# Altium schematic sheet SPE_router_spe.SchDoc: SPE Router
size 420 x 297 mm; Author: P. Daniel; CompanyName: WUT ISE; DrawnBy: P. Daniel; Organization: WUT ISE; Address1: WUT ISE; Address2: Nowowiejska 15/19 00-665 Warsaw; Address3: piotrmaciejdaniel@gmail.com; Revision: 1; SheetNumber: 4; SheetTotal: 4; ModifiedBy: -; CreateDate: 02-03.2023; CheckedDate: -; Title2: SPE PHY; DivGrp: WUT ISE; Designer: Piotr Daniel
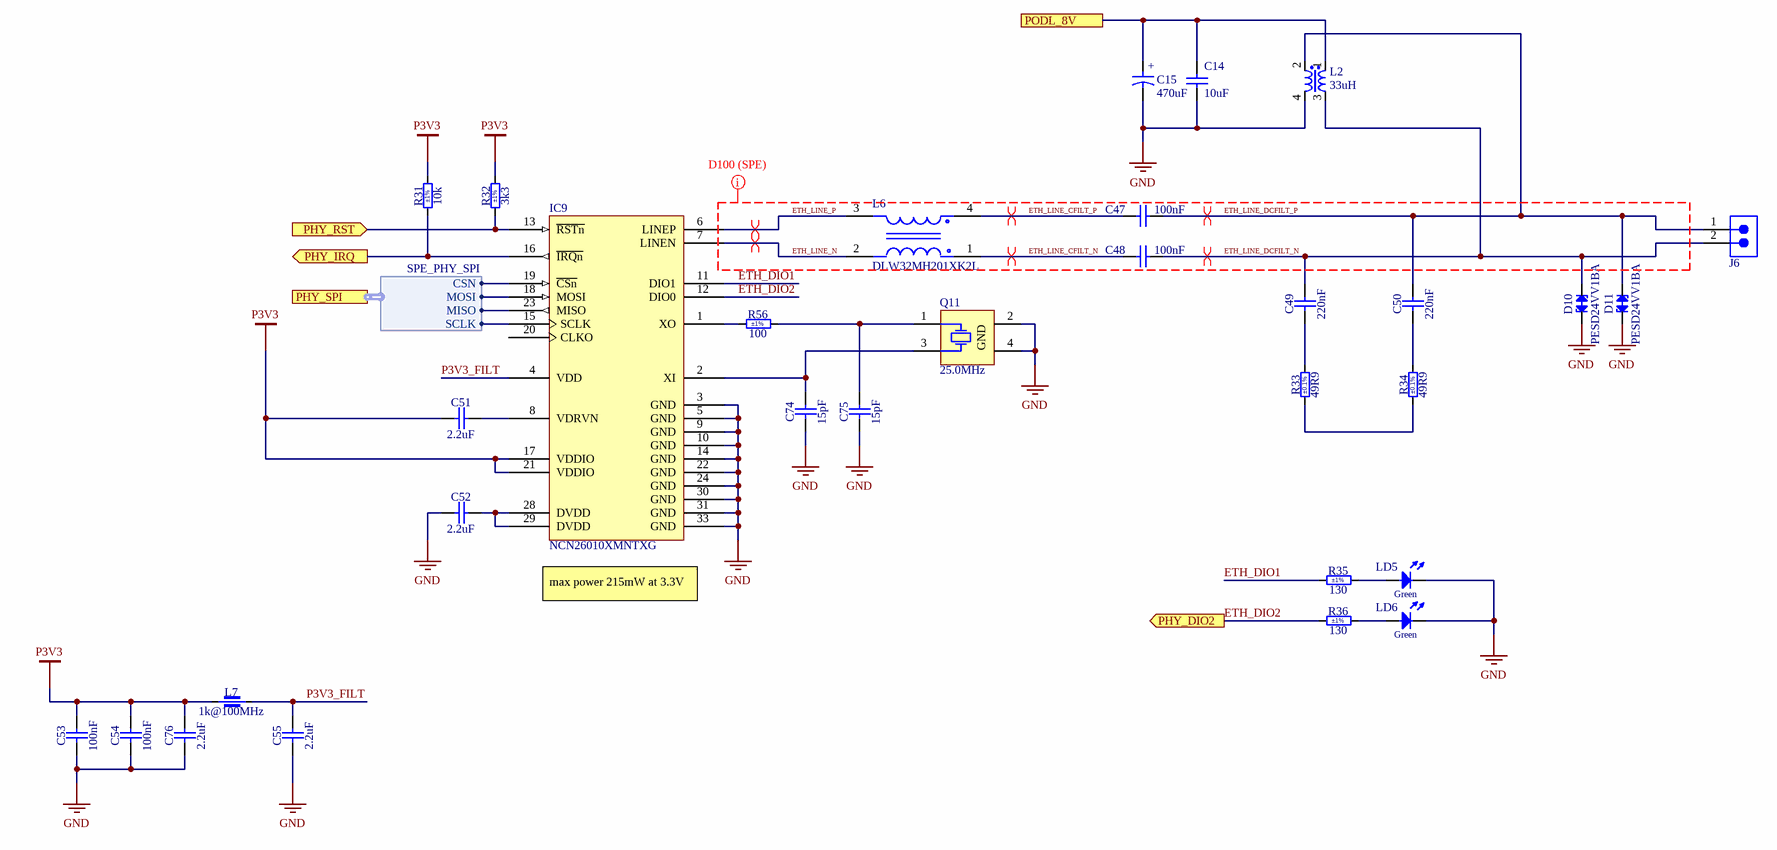
[diagram p0: SPE_router_spe.SchDoc]

## Parts
C14  10uF  [CAPC3216X180N]
C15  470uF  [CAPAE830X1020N]
C47  100nF  [CAPC1005X55N]
C48  100nF  [CAPC1005X55N]
C49  220nF  [CAPC2012X135N]
C50  220nF  [CAPC2012X135N]
C51  2.2uF  [CAPC1005X55N]
C52  2.2uF  [CAPC1005X55N]
C53  100nF  [CAPC1005X55N]
C54  100nF  [CAPC1005X55N]
C55  2.2uF  [CAPC1005X55N]
C74  15pF  [CAPC1005X55N]
C75  15pF  [CAPC1005X55N]
C76  2.2uF  [CAPC1005X55N]
D10  PESD24VV1BA  [SOD2512X110N]
D11  PESD24VV1BA  [SOD2512X110N]
IC9  NCN26010XMNTXG  [QFN40P400X400X100_HS-33N]
J6  691382040002  [691382040002]  (value not drawn)
L2  33uH  [MSD1278H-333MED]
L6  DLW32MH201XK2L  [FP-DLW32MH201XK2L-MFG]
L7  1k@100MHz  [INDC1608X100N]
LD5  Green  [LED_AVAGO_HSME-C110]
LD6  Green  [LED_AVAGO_HSME-C110]
Q11  25.0MHz  [XTAL_KYOCERA_CX3225SB]
R31  10k  Tolerance: ±1%  [RESC1005X40N]
R32  3k3  Tolerance: ±1%  [RESC1005X40N]
R33  49R9  Tolerance: ±0.1%  [RESC1608X55N]
R34  49R9  Tolerance: ±0.1%  [RESC1608X55N]
R35  130  Tolerance: ±1%  [RESC1005X40N]
R36  130  Tolerance: ±1%  [RESC1005X40N]
R56  100  Tolerance: ±1%  [RESC1005X40N]

## Ports
PHY_DIO2 (out), PHY_IRQ (out), PHY_RST (in), PHY_SPI (harness SPE_PHY_SPI), PODL_8V

## Harnesses
SPE_PHY_SPI: CSN, SCLK, MOSI, MISO

## Nets
GND: C14.1 C15.2 C52.1 C53.1 C54.1 C55.1 C74.1 C75.1 C76.1 D10.1(C) D11.1(C) IC9.3(GND) IC9.5(GND) IC9.9(GND) IC9.10(GND) IC9.14(GND) IC9.22(GND) IC9.24(GND) IC9.30(GND) IC9.31(GND) IC9.33(GND) L2.4 LD5.1(C) LD6.1(C) Q11.2(GND) Q11.4(GND)
P3V3: C51.1 C53.2 C54.2 C76.2 IC9.17(VDDIO) IC9.21(VDDIO) L7.1 R31.2 R32.2
ETH_DIO1: IC9.11(DIO1) R35.1
ETH_DIO2: IC9.12(DIO0) R36.1 ; port PHY_DIO2
ETH_LINE_CFILT_N: C48.1 L6.1
ETH_LINE_CFILT_P: C47.1 L6.4
ETH_LINE_DCFILT_N: C48.2 C49.2 D10.2(C) J6.2 L2.3
ETH_LINE_DCFILT_P: C47.2 C50.2 D11.2(C) J6.1 L2.2
ETH_LINE_N: IC9.7(LINEN) L6.2
ETH_LINE_P: IC9.6(LINEP) L6.3
P3V3_FILT: C55.2 IC9.4(VDD) L7.2
PHY_IRQ: IC9.16(~{IRQn}) R31.1 ; port PHY_IRQ
PHY_RST: IC9.13(~{RSTn}) R32.1 ; port PHY_RST
PODL_8V: C14.2 C15.1 L2.1 ; port PODL_8V
NetC49_1: C49.1 R33.2
NetC50_1: C50.1 R34.2
NetC51_2: C51.2 IC9.8(VDRVN)
NetC52_2: C52.2 IC9.28(DVDD) IC9.29(DVDD)
NetC74_2: C74.2 IC9.2(XI) Q11.3(X)
NetC75_2: C75.2 Q11.1(X) R56.2
NetIC9_1: IC9.1(XO) R56.1
NetIC9_15: IC9.15(SCLK) ; port PHY_SPI.SCLK
NetIC9_18: IC9.18(MOSI) ; port PHY_SPI.MOSI
NetIC9_19: IC9.19(~{CSn}) ; port PHY_SPI.CSN
NetIC9_23: IC9.23(MISO) ; port PHY_SPI.MISO
NetLD5_2: LD5.2(A) R35.2
NetLD6_2: LD6.2(A) R36.2
NetR33_1: R33.1 R34.1

Not connected (* = marked no-connect by the designer): IC9 20(CLKO)

## Layout directives
differential pair: ETH_LINE_CFILT_N, ETH_LINE_CFILT_P, ETH_LINE_DCFILT_N, ETH_LINE_DCFILT_P, ETH_LINE_N, ETH_LINE_P
rule Differential Pairs Routing [Pref Gap = 5mil    Min Gap  = 5mil    Max Gap  = 5milPref Width = 9.076mil    Min Width  = 3.515mil    Max Width  = 9.076mil]: ETH_LINE_CFILT_N, ETH_LINE_CFILT_P, ETH_LINE_DCFILT_N, ETH_LINE_DCFILT_P, ETH_LINE_N, ETH_LINE_P

## Notes on the sheet
- (near IC9) max power 215mW at 3.3V
- Project/Equipment
- Document
- Designer
- Drawn by
- Check.by
- Copyright WUT ISE 2021.
  This documentation describes Open Hardware and is licensed under the CERN OHL v.1.1. You may redistribute and modify this documentation under the terms of the CERN OHL v.1.1. (http://ohwr.org/CERNOHL). This documentation is distributed WITHOUT ANY EXPRESS OR IMPLIED WARRANTY, INCLUDING OF MERCHANTABILITY, SATISFACTORY QUALITY AND FITNESS FOR A PARTICULAR PURPOSE. Please see the CERN OHL v.1.1 for applicable conditions.
- Contact
- File
- Last Mod.
- Print Date
- Sheet
- Size
- A3
- of
- Rev
- (in symbol CAE830-1020_470UF_16V_20%) +

## Library data of the parts
C14 = CC1206_10UF_25V_10%_X7R: Non-polarised capacitor; Part Description: SMD Multilayer Chip Ceramic Capacitor; Manufacturer: GENERIC; Manufacturer1 Part Number: C1206C106K4RACTU; Voltage: 25V; TC: X7R; Tolerance: ±10%; Part Number: CC1206_10UF_25V_10%_X7R; Component Kind: Standard; Component Type: Standard; Pin Count: 2; Value: 10uF; Status: Preferred; Manufacturer Part Number: CC1206_10UF_25V_10%_X7R; Case: 1206; Mounted: Yes; Socket: No; SMD: Yes; Sense: No; Manufacturer1 Example: KEMET; Manufacturer1 ComponentHeight: 1.8mm; HelpURL: \\cern.ch\dfs\Applications\Altium\Datasheets\CC1206_X7R_KEMET.pdf; Author: CERN DEM JLC; CreateDate: 12.09.2012; LatestRevisionDate: 12.09.2012
C15 = CAE830-1020_470UF_16V_20%: Polarised capacitor; Part Description: Aluminum Electrolytic SMT Capacitor; Manufacturer: PANASONIC; Manufacturer Part Number: EEEFK1C471AP; Voltage: 16V; Tolerance: ±20%; Part Number: CAE830-1020_470UF_16V_20%; Component Kind: Standard; Component Type: Standard; Pin Count: 2; Value: 470uF; Status: Not Recommended; Case: F; Mounted: Yes; Socket: No; SMD: Yes; Sense: No; ComponentHeight: 10.2mm; HelpURL: \\cern.ch\dfs\Applications\Altium\Datasheets\CAE_PANASONIC_FK-V.pdf; Author: CERN DEM JLC; CreateDate: 03.12.2007; LatestRevisionDate: 05.11.2014
C47 C48 = CC0402_100NF_50V_10%_X7R: Non-polarised capacitor; Part Number: CC0402_100NF_50V_10%_X7R; Value: 100nF
C49 C50 = CC0805_220NF_100V_10%_X7R: Non-polarised capacitor; Part Description: SMD Multilayer Chip Ceramic Capacitor; Manufacturer: GENERIC; Manufacturer1 Part Number: GRM21AR72A224KAC5L; Voltage: 100V; TC: X7R; Tolerance: ±10%; Part Number: CC0805_220NF_100V_10%_X7R; Component Kind: Standard; Component Type: Standard; Pin Count: 2; Value: 220nF; Status: Preferred; Manufacturer Part Number: CC0805_220NF_100V_10%_X7R; Case: 0805; Mounted: Yes; Socket: No; SMD: Yes; Sense: No; Manufacturer1 Example: MURATA; Manufacturer1 ComponentHeight: 1mm; HelpURL: \\cern.ch\dfs\Applications\Altium\Datasheets\CC0805_MURATA_GRM21AR72A224KAC5L.pdf; Author: CERN DEM JLC; CreateDate: 08.06.2017; LatestRevisionDate: 08.06.2017
C51 C52 C55 C76 = CC0402_2.2UF_6.3V_10%_X5R: Non-polarised capacitor; Part Number: CC0402_2.2UF_6.3V_10%_X5R; Value: 2.2uF
C53 C54 = CC0402_100NF_16V_10%_X7R: Non-polarised capacitor; Part Description: SMD Multilayer Chip Ceramic Capacitor; Manufacturer: GENERIC; Manufacturer1 Part Number: GRM155R71C104KA88D; Voltage: 16V; TC: X7R; Tolerance: ±10%; Part Number: CC0402_100NF_16V_10%_X7R; Component Kind: Standard; Component Type: Standard; Pin Count: 2; Value: 100nF; Status: Not Recommended; Manufacturer Part Number: CC0402_100NF_16V_10%_X7R; Case: 0402; Mounted: Yes; Socket: No; SMD: Yes; Sense: No; Manufacturer1 Example: MURATA; Manufacturer1 ComponentHeight: 0.55mm; HelpURL: \\cern.ch\dfs\Applications\Altium\Datasheets\CC0402_X7R_MURATA_GRM.pdf; Author: CERN DEM JLC; CreateDate: 05.12.2013; LatestRevisionDate: 03.12.2007
C74 C75 = CC0402_15PF_50V_5%_C0G: Non-polarised capacitor; Part Description: SMD Multilayer Chip Ceramic Capacitor; Manufacturer: GENERIC; Manufacturer1 Part Number: C0402C150J5GACTU; Voltage: 50V; TC: C0G/NP0; Tolerance: ±5%; Part Number: CC0402_15PF_50V_5%_C0G; Component Kind: Standard; Component Type: Standard; Pin Count: 2; Value: 15pF; Status: Preferred; Manufacturer Part Number: CC0402_15PF_50V_5%_C0G; Case: 0402; Mounted: Yes; Socket: No; SMD: Yes; Sense: No; Manufacturer1 Example: KEMET; Manufacturer1 ComponentHeight: 0.55mm; HelpURL: \\cern.ch\dfs\Applications\Altium\Datasheets\CC0402_C0G_KEMET_(Commercial Grade).pdf; Author: CERN DEM JLC; CreateDate: 03.12.2007; LatestRevisionDate: 22.04.2015
D10 D11 = PESD24VL1BA: Bi-Directional ESD Protection Diode; Part Description: Low Capacitance 23kV Bidirectional ESD Protection Diode; Manufacturer: NXP SEMICONDUCTORS; Voltage: 24V; Power: 200W; PressFit: No; Bonding: No; Part Number: PESD24VV1BA; Component Kind: Standard; Component Type: Standard; Device: PESD24VV1BA; PackageDescription: Small Outline Diode (SOD-323), 1.70mm W X 1.25mm L X 1.10mm H body,  IPC Medium Density; Manufacturer Part Number: PESD24VV1BA; Pin Count: 2; Case: SOD323; Mounted: Yes; Socket: No; SMD: Yes; Sense: No; ComponentHeight: 1.1mm; HelpURL: \\cern.ch\dfs\Applications\Altium\Datasheets\PESD24VL1BA.pdf; Author: CERN DEM JLC; CreateDate: 26.02.2013; LatestRevisionDate: 26.02.2013
IC9 = NCN26010XMNTXG: Ethernet Controller, 10 Mb/s, Single-Pair, MAC + PHY, 802.3cg, 10BASE−T1S Compliant; Manufacturer: ON Semiconductor; Supplier 1: Arrow Electronics; Manufacturer Part Number: NCN26010XMNTXG; RoHS: No; Stock 1: 369; Pricing 1: 1=7,29220, 10=6,57460, 25=6,24800, 100=5,59360, 250=5,34180 (USD); Supplier Part Number 1: NCN26010XMNTXG
J6 = 691382040002: WR-TBL Series 382 Horizontal PCB Header with Flanges, THT, pitch 2.5mm, 2p; Manufacturer: Wurth Elektronik; Modularity: No; Rated Current: 12A; Working Voltage: 300V; ComponentLink1Description: Website Link; ComponentLink1URL: https://www.we-online.com/redexpert/article/691382040002?ad; ComponentLink2Description: Datasheet Link; ComponentLink2URL: https://www.we-online.com/redexpert/spec/691382040002?ad; Manufacturer Part Number: 691382040002; Category: Terminal Blocks; Match Code: WR-TBL; Mount: Through Hole; Operating Temperature Max: 105°C; Operating Temperature Min: -40°C; Packaging: Box; Application: Pluggable; Number of Pins: 2; Number of Rows: 1; Orientation: Horizontal; Pitch: 2.5mm
L2 = MSD1278H-333MED: coupled inductor, ferrite core, SMT, RoHS; Manufacturer: Coilcraft; Manufacturer Part Number: MSD1278H-333MED; RoHS: Yes; Category: Inductors; Stock 1: 123; RoHS Compliant: No
L6 = CMP-06045-000003-1: 200UH-20%/+50% (AT 0.1MHZ)70MA R; Manufacturer: Murata; Inductance: 200uH; Automotive Grade: Grade 1; Tolerance: -20/+50%; Value: 200uH; Series Resistance: 4.8Ω; Automotive: Yes; Manufacturer Part Number: DLW32MH201XK2L; Temperature Range Low: -40°C; ComponentLink2URL: https://www.murata.com/products/productdata/8801029685278/QFLC9124.pdf?1544104811000; Lead Free: Yes; Device Class L3: Common Mode Chokes; Device Class L2: EMI / RFI Components; Rms Current: 70mA; Octopart: https://octopart.com/dlw32mh201xk2l-murata-91401020; Digikey Description: 200UH-20%/+50% (AT 0.1MHZ)70MA R; Temperature: -40°C to +125°C; Test Frequency: 0.1MHz; Category: Ind; Package: 0; Temperature Range High: +125°C; ComponentLink2Description: Datasheet; Device Class L1: Passive Components; RoHS: TRUE; Composition: Wirewound; Height: 2.5mm; Mouser Description: Common Mode Chokes Dual 200uH 100kHz 0.07A 4.8Ohm DCR SMD Automotive T/R
L7 = IND0603_WURTH_74279266: Part Description: SMD EMI Suppression Chip Ferrite Bead (WE-CBF Series); Manufacturer: WURTH ELEKTRONIK; Power: 200mA; Resistance: 0.6R; Tolerance: ±25%; Part Number: IND0603_WURTH_74279266; Component Kind: Standard; Component Type: Standard; Pin Count: 2; Value: 1k@100MHz; Manufacturer Part Number: 74279266; Case: 0603; Mounted: Yes; Socket: No; SMD: Yes; Sense: No; ComponentHeight: 1mm; HelpURL: \\cern.ch\dfs\Applications\Altium\Datasheets\IND0603_WURTH_74279266.pdf; Author: CERN DEM JLC; CreateDate: 08.03.2011; LatestRevisionDate: 25.10.2018
LD5 LD6 = LED_AVAGO_HSME-C110: LED Green 1C 2A; Part Description: High Performance Right Angle Chip Green LED; Manufacturer: AVAGO TECHNOLOGIES; PressFit: No; Bonding: No; Part Number: LED_AVAGO_HSME-C110; Component Kind: Standard; Component Type: Standard; Color: Green; PackageDescription: Green Chip LED, 2-Leads, Body 3.3x1.6mm, Side Emitting Package; Manufacturer Part Number: HSME-C110; Pin Count: 2; Case: 1206; Mounted: Yes; Socket: No; SMD: Yes; Sense: No; ComponentHeight: 1.1mm; HelpURL: \\cern.ch\dfs\Applications\Altium\Datasheets\LED_AVAGO_HSME-C110.pdf; ComponentLink1URL: \\cern.ch\dfs\Applications\Altium\Datasheets\LED_AVAGO_HSME-C110_DESIGN-GUIDE.pdf; ComponentLink1Description: Design Guide; Author: CERN DEM JMW; CreateDate: 30.07.2009; LatestRevisionDate: 20.06.2012
Q11 = ECS-250-12-33B-CWY-TR3: Crystal 25 Mhz 12PF SMD; Manufacturer: ECS International; Supplier 1: Digikey; Manufacturer Part Number: ECS-250-12-33B-CWY-TR3; RoHS: No; Category: Uncategorized; Stock 1: 1965; Pricing 1: 1=0,45, 10=0,376, 50=0,3386, 100=0,301, 500=0,28594, 1000=0,24078 (USD); Supplier Part Number 1: 50-ECS-250-12-33B-CWY-TR3CT-ND; Value: 25.0MHz
R31 = R0402_10K_1%_0.0625W_100PPM: Resistor - 1%; Part Description: General Purpose Thick Film Chip Resistor; Manufacturer: GENERIC; Manufacturer1 Part Number: 232270671003L; TC: ±100ppm/°C; PressFit: No; Part Number: R0402_10K_1%_0.0625W_100PPM; Component Kind: Standard; Component Type: Standard; Pin Count: 2; Value: 10k; Status: Not Recommended; Power: 0.0625W; Manufacturer Part Number: R0402_10K_1%_0.0625W_100PPM; Case: 0402; Mounted: Yes; Sense: No; Socket: No; SMD: Yes; Manufacturer1 Example: YAGEO PHYCOMP; Manufacturer1 ComponentHeight: 0.4mm; HelpURL: \\cern.ch\dfs\Applications\Altium\Datasheets\R0402_Phycomp_RC0402.pdf; Author: CERN DEM JLC; CreateDate: 03.12.2007; LatestRevisionDate: 17.10.2012
R32 = R0402_3K3_1%_0.0625W_100PPM: Resistor - 1%; Part Description: General Purpose Thick Film Chip Resistor; Manufacturer: GENERIC; Manufacturer1 Part Number: 232270673302L; TC: ±100ppm/°C; PressFit: No; Part Number: R0402_3K3_1%_0.0625W_100PPM; Component Kind: Standard; Component Type: Standard; Pin Count: 2; Value: 3k3; Status: Not Recommended; Power: 0.0625W; Manufacturer Part Number: R0402_3K3_1%_0.0625W_100PPM; Case: 0402; Mounted: Yes; Sense: No; Socket: No; SMD: Yes; Manufacturer1 Example: YAGEO PHYCOMP; Manufacturer1 ComponentHeight: 0.4mm; HelpURL: \\cern.ch\dfs\Applications\Altium\Datasheets\R0402_Phycomp_RC0402.pdf; Author: CERN DEM JLC; CreateDate: 03.12.2007; LatestRevisionDate: 17.10.2012
R33 R34 = R0603_49R9_0.1%_0.063W_10PPM: Resistor - 0.1%; Part Description: Thin Film Chip Resistor; Manufacturer: GENERIC; Manufacturer1 Part Number: RN73C1J49R9BTDF; Power: 0.063W; TC: ±10ppm; PressFit: No; Part Number: R0603_49R9_0.1%_0.063W_10PPM; Component Kind: Standard; Component Type: Standard; Pin Count: 2; Value: 49R9; Status: Not Recommended; Manufacturer Part Number: R0603_49R9_0.1%_0.063W_10PPM; Case: 0603; Mounted: Yes; Sense: No; Socket: No; SMD: Yes; Manufacturer1 Example: TYCO HOLSWORTHY; Manufacturer1 ComponentHeight: 0.5mm; HelpURL: \\cern.ch\dfs\Applications\Altium\Datasheets\R0603_Tyco_RN73.pdf; Author: CERN DEM JLC; CreateDate: 03.12.2007; LatestRevisionDate: 13.03.2008
R35 R36 = R0402_130R_1%_0.0625W_100PPM: Resistor - 1%; Part Description: General Purpose Thick Film Chip Resistor; Manufacturer: GENERIC; Manufacturer1 Part Number: 232270671301L; TC: ±100ppm/°C; PressFit: No; Part Number: R0402_130R_1%_0.0625W_100PPM; Component Kind: Standard; Component Type: Standard; Pin Count: 2; Value: 130; Status: Not Recommended; Power: 0.0625W; Manufacturer Part Number: R0402_130R_1%_0.0625W_100PPM; Case: 0402; Mounted: Yes; Sense: No; Socket: No; SMD: Yes; Manufacturer1 Example: YAGEO PHYCOMP; Manufacturer1 ComponentHeight: 0.4mm; HelpURL: \\cern.ch\dfs\Applications\Altium\Datasheets\R0402_Phycomp_RC0402.pdf; Author: CERN DEM JLC; CreateDate: 03.12.2007; LatestRevisionDate: 17.10.2012
R56 = R0402_100R_1%_0.0625W_100PPM: Resistor - 1%; Part Description: General Purpose Thick Film Chip Resistor; Manufacturer: GENERIC; Manufacturer1 Part Number: 232270671001L; PressFit: No; TC: ±100ppm/°C; Part Number: R0402_100R_1%_0.0625W_100PPM; Component Kind: Standard; Component Type: Standard; Pin Count: 2; Value: 100; Status: Not Recommended; Manufacturer Part Number: R0402_100R_1%_0.0625W_100PPM; Case: 0402; Mounted: Yes; Sense: No; Socket: No; SMD: Yes; Manufacturer1 Example: YAGEO PHYCOMP; Manufacturer1 ComponentHeight: 0.4mm; HelpURL: \\cern.ch\dfs\Applications\Altium\Datasheets\R0402_Phycomp_RC0402.pdf; Author: CERN DEM JLC; CreateDate: 03.12.2007; LatestRevisionDate: 17.10.2012; Power: 0.0625W